# EAGLE design Basic_Proto_Cape_A1 (EAGLE 6.5.0)
AUTHOR: HIEU DUONG; CCO: WWW.CIRCUITCO.COM; DN: 999-0004263; REV: A1; TITLE: BASIC PROTO CAPE
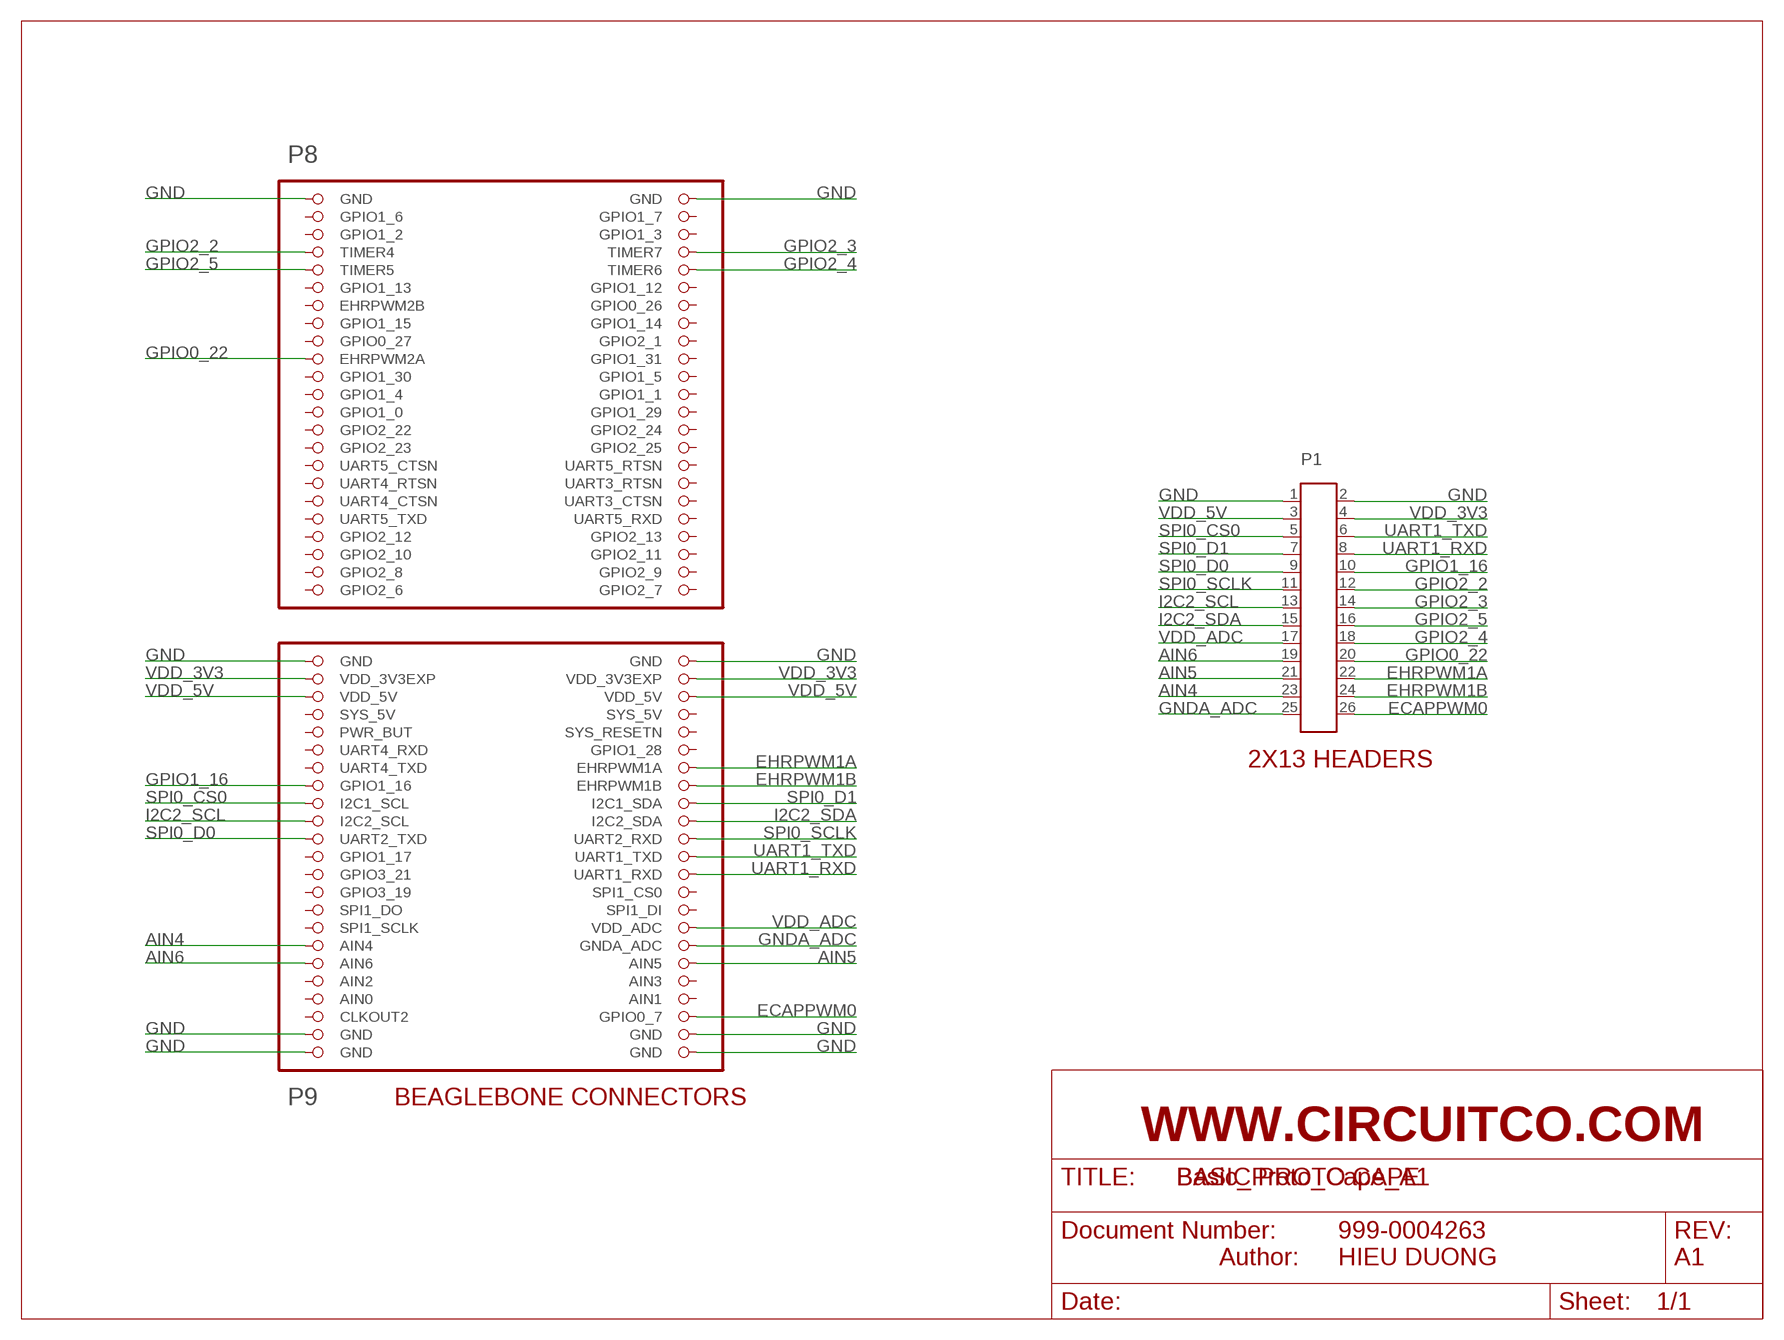
[diagram p0: schematic, sheet 1]

## Parts
P1  HEADER2X13TH  [2X13-TH]
U1  BB_OL_GENPROTO  [BB_OL_GENPROTO]

## Nets
AIN4: P1.23 U1.79(AIN4)
AIN5: P1.21 U1.82(AIN5)
AIN6: P1.19 U1.81(AIN6)
ECAPPWM0: P1.26 U1.88(GPIO0_7)
EHRPWM1A: P1.22 U1.60(EHRPWM1A)
EHRPWM1B: P1.24 U1.62(EHRPWM1B)
GND: P1.1 P1.2 U1.1(GND) U1.2(GND) U1.47(GND) U1.48(GND) U1.89(GND) U1.90(GND) U1.91(GND) U1.92(GND)
GNDA_ADC: P1.25 U1.80(GNDA_ADC)
GPIO0_22: P1.20 U1.19(EHRPWM2A)
GPIO1_16: P1.10 U1.61(GPIO1_16)
GPIO2_2: P1.12 U1.7(TIMER4)
GPIO2_3: P1.14 U1.8(TIMER7)
GPIO2_4: P1.18 U1.10(TIMER6)
GPIO2_5: P1.16 U1.9(TIMER5)
I2C2_SCL: P1.13 U1.65(I2C2_SCL)
I2C2_SDA: P1.15 U1.66(I2C2_SDA)
SPI0_CS0: P1.5 U1.63(I2C1_SCL)
SPI0_D0: P1.9 U1.67(UART2_TXD)
SPI0_D1: P1.7 U1.64(I2C1_SDA)
SPI0_SCLK: P1.11 U1.68(UART2_RXD)
UART1_RXD: P1.8 U1.72(UART1_RXD)
UART1_TXD: P1.6 U1.70(UART1_TXD)
VDD_3V3: P1.4 U1.49(VDD_3V3EXP) U1.50(VDD_3V3EXP)
VDD_5V: P1.3 U1.51(VDD_5V) U1.52(VDD_5V)
VDD_ADC: P1.17 U1.78(VDD_ADC)
Unconnected: U1.3(GPIO1_6) U1.4(GPIO1_7) U1.5(GPIO1_2) U1.6(GPIO1_3) U1.11(GPIO1_13) U1.12(GPIO1_12) U1.13(EHRPWM2B) U1.14(GPIO0_26) U1.15(GPIO1_15) U1.16(GPIO1_14) U1.17(GPIO0_27) U1.18(GPIO2_1) U1.20(GPIO1_31) U1.21(GPIO1_30) U1.22(GPIO1_5) U1.23(GPIO1_4) U1.24(GPIO1_1) U1.25(GPIO1_0) U1.26(GPIO1_29) U1.27(GPIO2_22) U1.28(GPIO2_24) U1.29(GPIO2_23) U1.30(GPIO2_25) U1.31(UART5_CTSN) U1.32(UART5_RTSN) U1.33(UART4_RTSN) U1.34(UART3_RTSN) U1.35(UART4_CTSN) U1.36(UART3_CTSN) U1.37(UART5_TXD) U1.38(UART5_RXD) U1.39(GPIO2_12) U1.40(GPIO2_13) U1.41(GPIO2_10) U1.42(GPIO2_11) U1.43(GPIO2_8) U1.44(GPIO2_9) U1.45(GPIO2_6) U1.46(GPIO2_7) U1.54(SYS_5V) U1.55(PWR_BUT) U1.56(SYS_RESETN) U1.57(UART4_RXD) U1.58(GPIO1_28) U1.59(UART4_TXD) U1.69(GPIO1_17) U1.71(GPIO3_21) U1.73(GPIO3_19) U1.74(SPI1_CS0) U1.75(SPI1_DO) U1.76(SPI1_DI) U1.77(SPI1_SCLK) U1.83(AIN2) U1.84(AIN3) U1.86(AIN1) U1.87(CLKOUT2)

## Notes on the sheet
- P8
- 2X13 HEADERS
- P9 | BEAGLEBONE CONNECTORS
- Author:

## Power pins joined to a net without a drawn wire
AIN0: U1.85(AIN0)
SYS_5V: U1.53(SYS_5V)

## Library data of the parts
P1 = circuitco-eagle:HEADER2X13TH
U1 = circuitco-eagle:BB_OL_GENPROTO

## Board
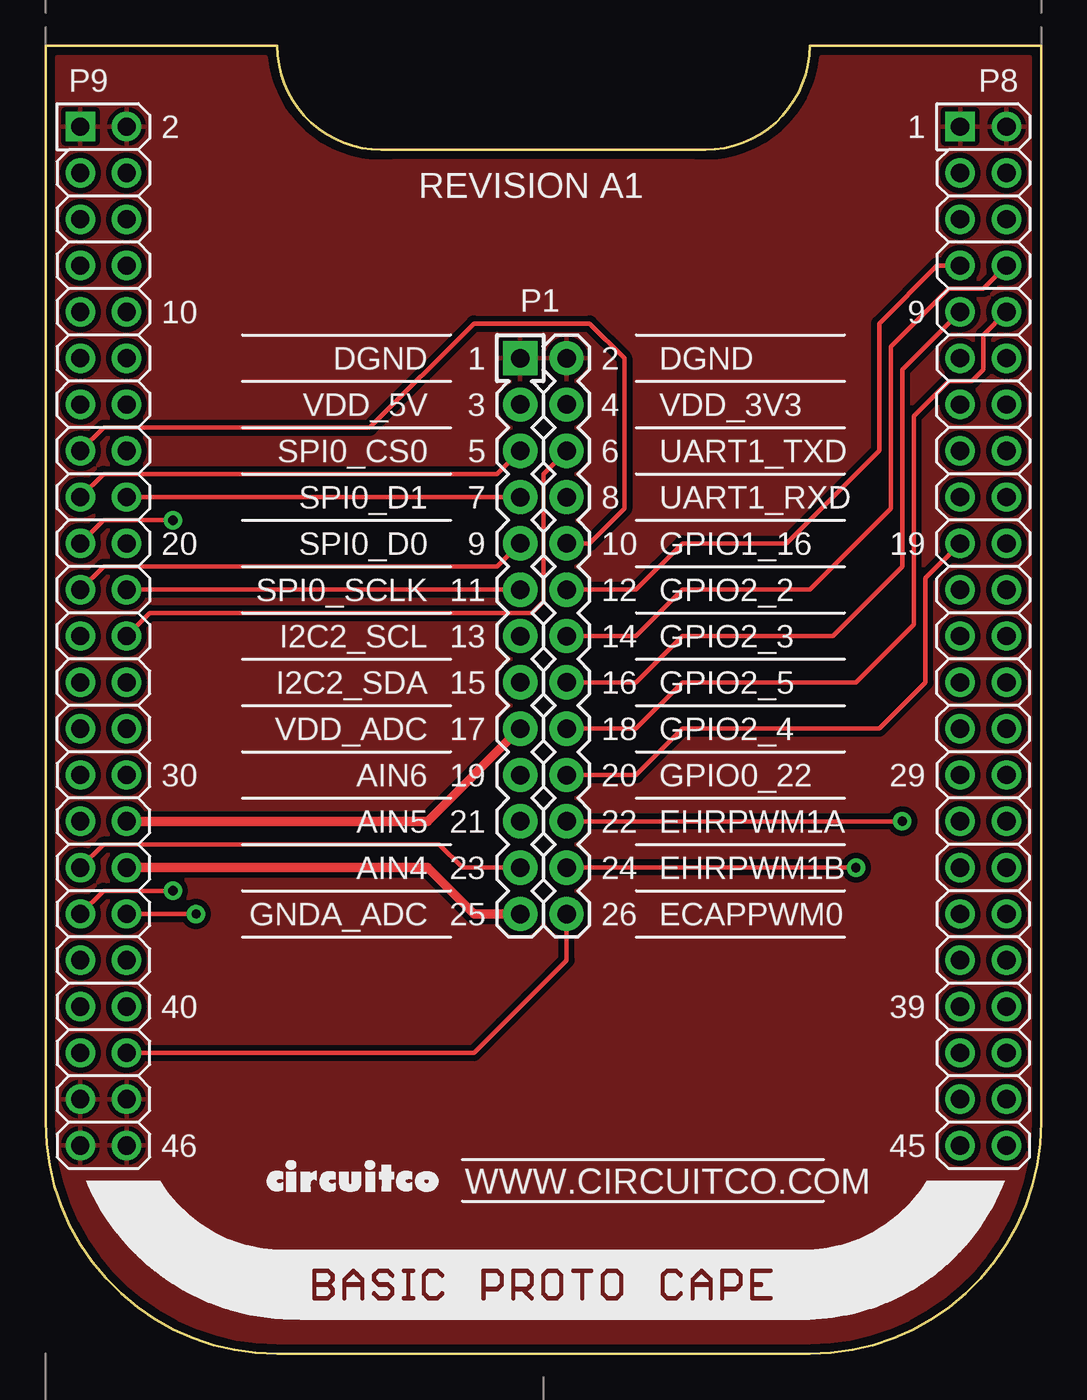
[diagram p1: board, top side]
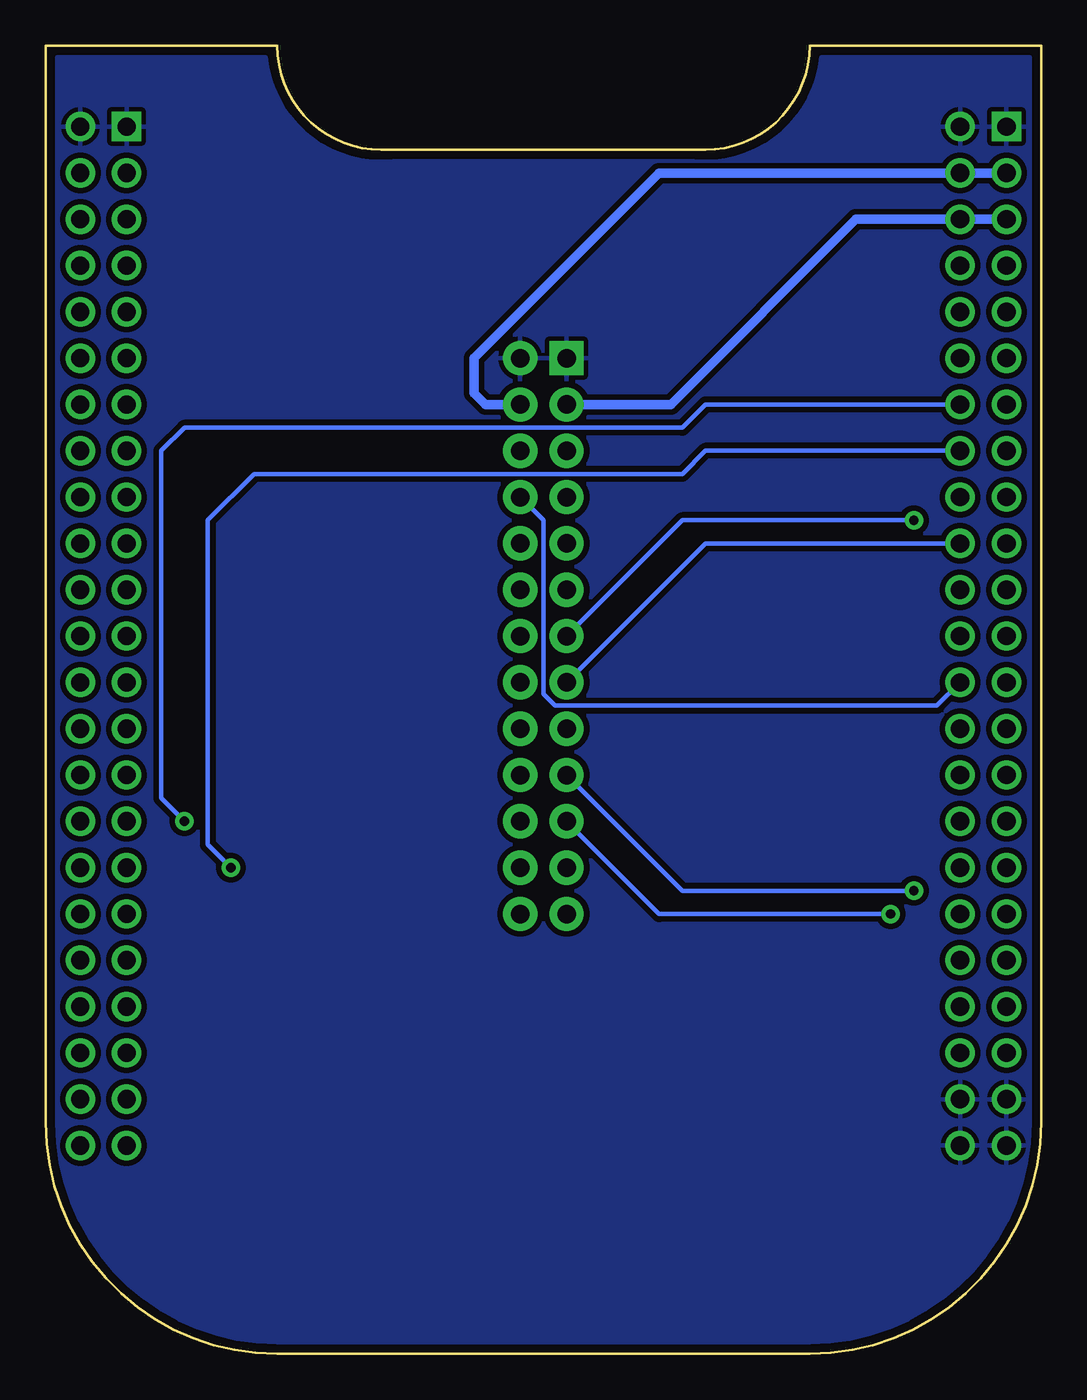
[diagram p2: board, bottom side, seen from below]

Size 54.61 x 71.75 mm. Coordinates in mm from the lower left corner, seen from the top.
Copper layers (1*16): Top 0.035mm / dielectric 1.5mm / Bottom 0.035mm
Design rules "CircuitCo-HD": minimum track width 8mil, minimum drill 15mil, track to track 8mil, track to pad 8mil, pad to pad 3mil, via to via 8mil, smd to smd 0mil, copper to edge 12mil, drill to drill 8mil, minimum pad ring 12mil, minimum via ring 10mil, stop-mask expansion 4mil, vias tented up to drill 25mil, thermal gap 10mil

### Footprints (pad centres in the part's own frame; a part is rotated, then mirrored left to right if it is on the bottom)
2X13-TH = drill 1.016 pad 1.88 square: 1 -1.27,13.97 | drill 1.016 pad 1.88: 2 1.27,13.97; 3 -1.27,11.43; 4 1.27,11.43; 5 -1.27,8.89; 6 1.27,8.89; 7 -1.27,6.35; 8 1.27,6.35; 9 -1.27,3.81; 10 1.27,3.81; 11 -1.27,1.27; 12 1.27,1.27; 13 -1.27,-1.27; 14 1.27,-1.27; 15 -1.27,-3.81; 16 1.27,-3.81; 17 -1.27,-6.35; 18 1.27,-6.35; 19 -1.27,-8.89; 20 1.27,-8.89; 21 -1.27,-11.43; 22 1.27,-11.43; 23 -1.27,-13.97; 24 1.27,-13.97; 25 -1.27,-16.51; 26 1.27,-16.51
BB_OL_GENPROTO = drill 1 square: 1 50.165,67.31; 47 1.905,67.31 | drill 1: 2 52.705,67.31; 3 50.165,64.77; 4 52.705,64.77; 5 50.165,62.23; 6 52.705,62.23; 7 50.165,59.69; 8 52.705,59.69; 9 50.165,57.15; 10 52.705,57.15; 11 50.165,54.61; 12 52.705,54.61; 13 50.165,52.07; 14 52.705,52.07; 15 50.165,49.53; 16 52.705,49.53; 17 50.165,46.99; 18 52.705,46.99; 19 50.165,44.45; 20 52.705,44.45; 21 50.165,41.91; 22 52.705,41.91; 23 50.165,39.37; 24 52.705,39.37; 25 50.165,36.83; 26 52.705,36.83; 27 50.165,34.29; 28 52.705,34.29; 29 50.165,31.75; 30 52.705,31.75; 31 50.165,29.21; 32 52.705,29.21; 33 50.165,26.67; 34 52.705,26.67; 35 50.165,24.13; 36 52.705,24.13; 37 50.165,21.59; 38 52.705,21.59; 39 50.165,19.05; 40 52.705,19.05; 41 50.165,16.51; 42 52.705,16.51; 43 50.165,13.97; 44 52.705,13.97; 45 50.165,11.43; 46 52.705,11.43; 48 4.445,67.31; 49 1.905,64.77; 50 4.445,64.77; 51 1.905,62.23; 52 4.445,62.23; 53 1.905,59.69; 54 4.445,59.69; 55 1.905,57.15; 56 4.445,57.15; 57 1.905,54.61; 58 4.445,54.61; 59 1.905,52.07; 60 4.445,52.07; 61 1.905,49.53; 62 4.445,49.53; 63 1.905,46.99; 64 4.445,46.99; 65 1.905,44.45; 66 4.445,44.45; 67 1.905,41.91; 68 4.445,41.91; 69 1.905,39.37; 70 4.445,39.37; 71 1.905,36.83; 72 4.445,36.83; 73 1.905,34.29; 74 4.445,34.29; 75 1.905,31.75; 76 4.445,31.75; 77 1.905,29.21; 78 4.445,29.21; 79 1.905,26.67; 80 4.445,26.67; 81 1.905,24.13; 82 4.445,24.13; 83 1.905,21.59; 84 4.445,21.59; 85 1.905,19.05; 86 4.445,19.05; 87 1.905,16.51; 88 4.445,16.51; 89 1.905,13.97; 90 4.445,13.97; 91 1.905,11.43; 92 4.445,11.43

### Placement (x,y rotation side)
DRILEGEND  [DRILEGEND]  -3.7,-17.36 0 top  (outside the outline)
P1  27.3,40.64 0 top
U1  0,0 0 top
U$1  [CIRCUITCO-LOGO]  12.06,8.76 0 top
U$2  [NEGA-BSXPROTO-NAME]  0.64,1.27 0 top

### Tracks (layer width: path | path; a pad name or v marks a point on that pad's centre or on a via)
AIN4
  Top 0.254: P1.23 22.86,26.67 21.59,27.94 3.17,27.94 U1.79
AIN5  (via drill 0.51)
  Top 0.254: U1.82 v8.26,24.13
  Bottom 0.254: v8.26,24.13 20.95,24.13 P1.21
AIN6  (via drill 0.51)
  Top 0.254: U1.81 3.17,25.4 v6.99,25.4
  Bottom 0.254: v6.99,25.4 19.68,25.4 P1.19
ECAPPWM0
  Top 0.254: U1.88 23.5,16.51 28.57,21.59 P1.26
EHRPWM1A  (via drill 0.51)
  Top 0.254: v46.99,29.21 P1.22
  Bottom 0.254: U1.60 18.41,52.07 19.68,50.8 46.99,50.8 48.26,49.53 48.26,30.48 v46.99,29.21
EHRPWM1B  (via drill 0.51)
  Top 0.254: v44.45,26.67 P1.24
  Bottom 0.254: U1.62 18.41,49.53 19.68,48.26 43.18,48.26 45.72,45.72 45.72,27.94 v44.45,26.67
GND
  pour Bottom (isolate 0.305): 0.64,71.12 12.06,71.12 arc90 19.05,65.41 35.56,65.41 arc90 42.55,71.12 53.98,71.12 53.98,12.7 arc-90 41.91,0.64 12.7,0.64 arc-90 0.64,12.7
  pour Top (isolate 0.305): 0.64,71.12 12.06,71.12 arc90 19.05,65.41 35.56,65.41 arc90 42.55,71.12 53.98,71.12 53.98,12.7 arc-90 41.91,0.64 12.7,0.64 arc-90 0.64,12.7
GNDA_ADC
  Top 0.508: U1.80 20.95,26.67 23.5,24.13 P1.25
GPIO0_22
  Top 0.254: P1.20 32.38,31.75 34.92,34.29 45.72,34.29 48.26,36.83 48.26,42.55 U1.19
GPIO1_16
  Top 0.254: U1.61 3.17,50.8 17.78,50.8 23.5,56.52 29.84,56.52 31.75,54.61 31.75,46.35 29.84,44.45 P1.10
GPIO2_2
  Top 0.254: P1.12 32.38,41.91 34.92,44.45 40.64,44.45 45.72,49.53 45.72,56.52 48.9,59.69 U1.7
GPIO2_3
  Top 0.254: P1.14 32.38,39.37 34.92,41.91 41.91,41.91 46.35,46.35 46.35,55.24 49.53,58.42 51.44,58.42 U1.8
GPIO2_4
  Top 0.254: P1.18 32.38,34.29 34.92,36.83 44.45,36.83 47.62,40.01 47.62,51.44 49.53,53.34 50.8,53.34 51.44,53.98 51.44,55.88 U1.10
GPIO2_5
  Top 0.254: P1.16 32.38,36.83 34.92,39.37 43.18,39.37 46.99,43.18 46.99,53.98 U1.9
I2C2_SCL  (via drill 0.51)
  Top 0.254: U1.65 3.17,45.72 v6.99,45.72
  Bottom 0.254: v6.99,45.72 19.68,45.72 P1.13
I2C2_SDA
  Bottom 0.254: U1.66 18.41,44.45 P1.15
SPI0_CS0
  Top 0.254: U1.63 3.17,48.26 24.77,48.26 P1.5
SPI0_D0
  Top 0.254: U1.67 3.17,43.18 24.77,43.18 P1.9
SPI0_D1
  Top 0.254: U1.64 P1.7
SPI0_SCLK
  Top 0.254: U1.68 P1.11
UART1_RXD
  Bottom 0.254: P1.8 27.3,45.72 27.3,36.2 26.67,35.56 5.71,35.56 U1.72
UART1_TXD
  Top 0.254: U1.70 5.71,40.64 26.67,40.64 27.3,41.27 27.3,48.26 P1.6
VDD_3V3
  Bottom 0.508: U1.49 U1.50 20.95,64.77 31.11,54.61 31.11,52.7 30.48,52.07 P1.4
VDD_5V
  Bottom 0.508: U1.51 U1.52 10.16,62.23 20.32,52.07 P1.3
VDD_ADC
  Top 0.508: U1.78 20.95,29.21 P1.17

### Text on the board
tPlace: P8 | P9 | 1 | 2 | REVISION A1 | 9 | 10 | P1 | DGND | 1 | 2 | DGND | VDD_5V | 3 | 4 | VDD_3V3 | SPI0_CS0 | 5 | 6 | UART1_TXD | SPI0_D1 | 7 | 8 | UART1_RXD | SPI0_D0 | 9 | 19 | 20 | 10 | GPIO1_16 | SPI0_SCLK | 11 | 12 | GPIO2_2 | I2C2_SCL | 13 | 14 | GPIO2_3 | I2C2_SDA | 15 | 16 | GPIO2_5 | VDD_ADC | 17 | 18 | GPIO2_4 | AIN6 | 19 | 29 | 30 | 20 | GPIO0_22 | AIN5 | 21 | 22 | EHRPWM1A | AIN4 | 23 | 24 | EHRPWM1B | GNDA_ADC | 25 | 26 | ECAPPWM0 | 39 | 40 | 45 | 46 | WWW.CIRCUITCO.COM
Document: BASIC PROTO CAPE REV A1 / ASSEMBLY DRAWING - TOP VIEW
DrillLegend: -ALL DIMENSIONS IN INCHES UNESS | OTHERWISE NOTED | - NO. LAYERS: 2 | - ARRAY: NO | - BOARD SIZE: 2.150000 x 2.825000 In. | - X-OUTS ALLOWED: YES | - SCORING: YES | - JUMP SCORING: NO | - TAB ROUT: NO | - MATERIAL: FR-4 | - FINAL THICKNESS: 0.062000 | - PLATING: IMMERSION GOLD | - OUTER CU WEIGHT: 1.000000 | - MASK SIDES: BOTH | - MASK COLOR: WHITE | - SILKSCREEN SIDES: FRONT | - SILKSCREEN COLOR: BLACK | - GOLD FINGERS: NO | - MIN TRACE/SPACE: 8 | - MIN HOLE SIZE: 15 | - NO. HOLES UNDER 12 MIL: 0 | - PLATED SLOTS: NO | - PLATED EDGES: NO | - RoHS COMPLIANT: YES | - ITAR COMPLIANT: NO | - CONFORM TO IPC-A-600, CLASS 2: YES | - CLASS 3: NO | - MILSPEC: NO | - ADD UL LOGO: YES | - ADD DATE CODE: YES | - ADD 94V-0 MARKINGS: YES | - COUNTERSINKS/BORES: NO | - CONTROLLED DIELECTRIC: NO | - CARBON INK: NO | - BLIND/BURRIED VIAS: NO | - VIA IN PAD: NO | - MASK PLUGGED VIAS: NO | - CONDUCTIVE FILLED VIAS: NO | - CONTROLLED IMPEDANCE: NO | LAYER-STACK
DrillLegend_01-16: 01-16